# EAGLE schematic PnP-Expansion-V1 (EAGLE 9.3.0)

## Sheet 1 of 4
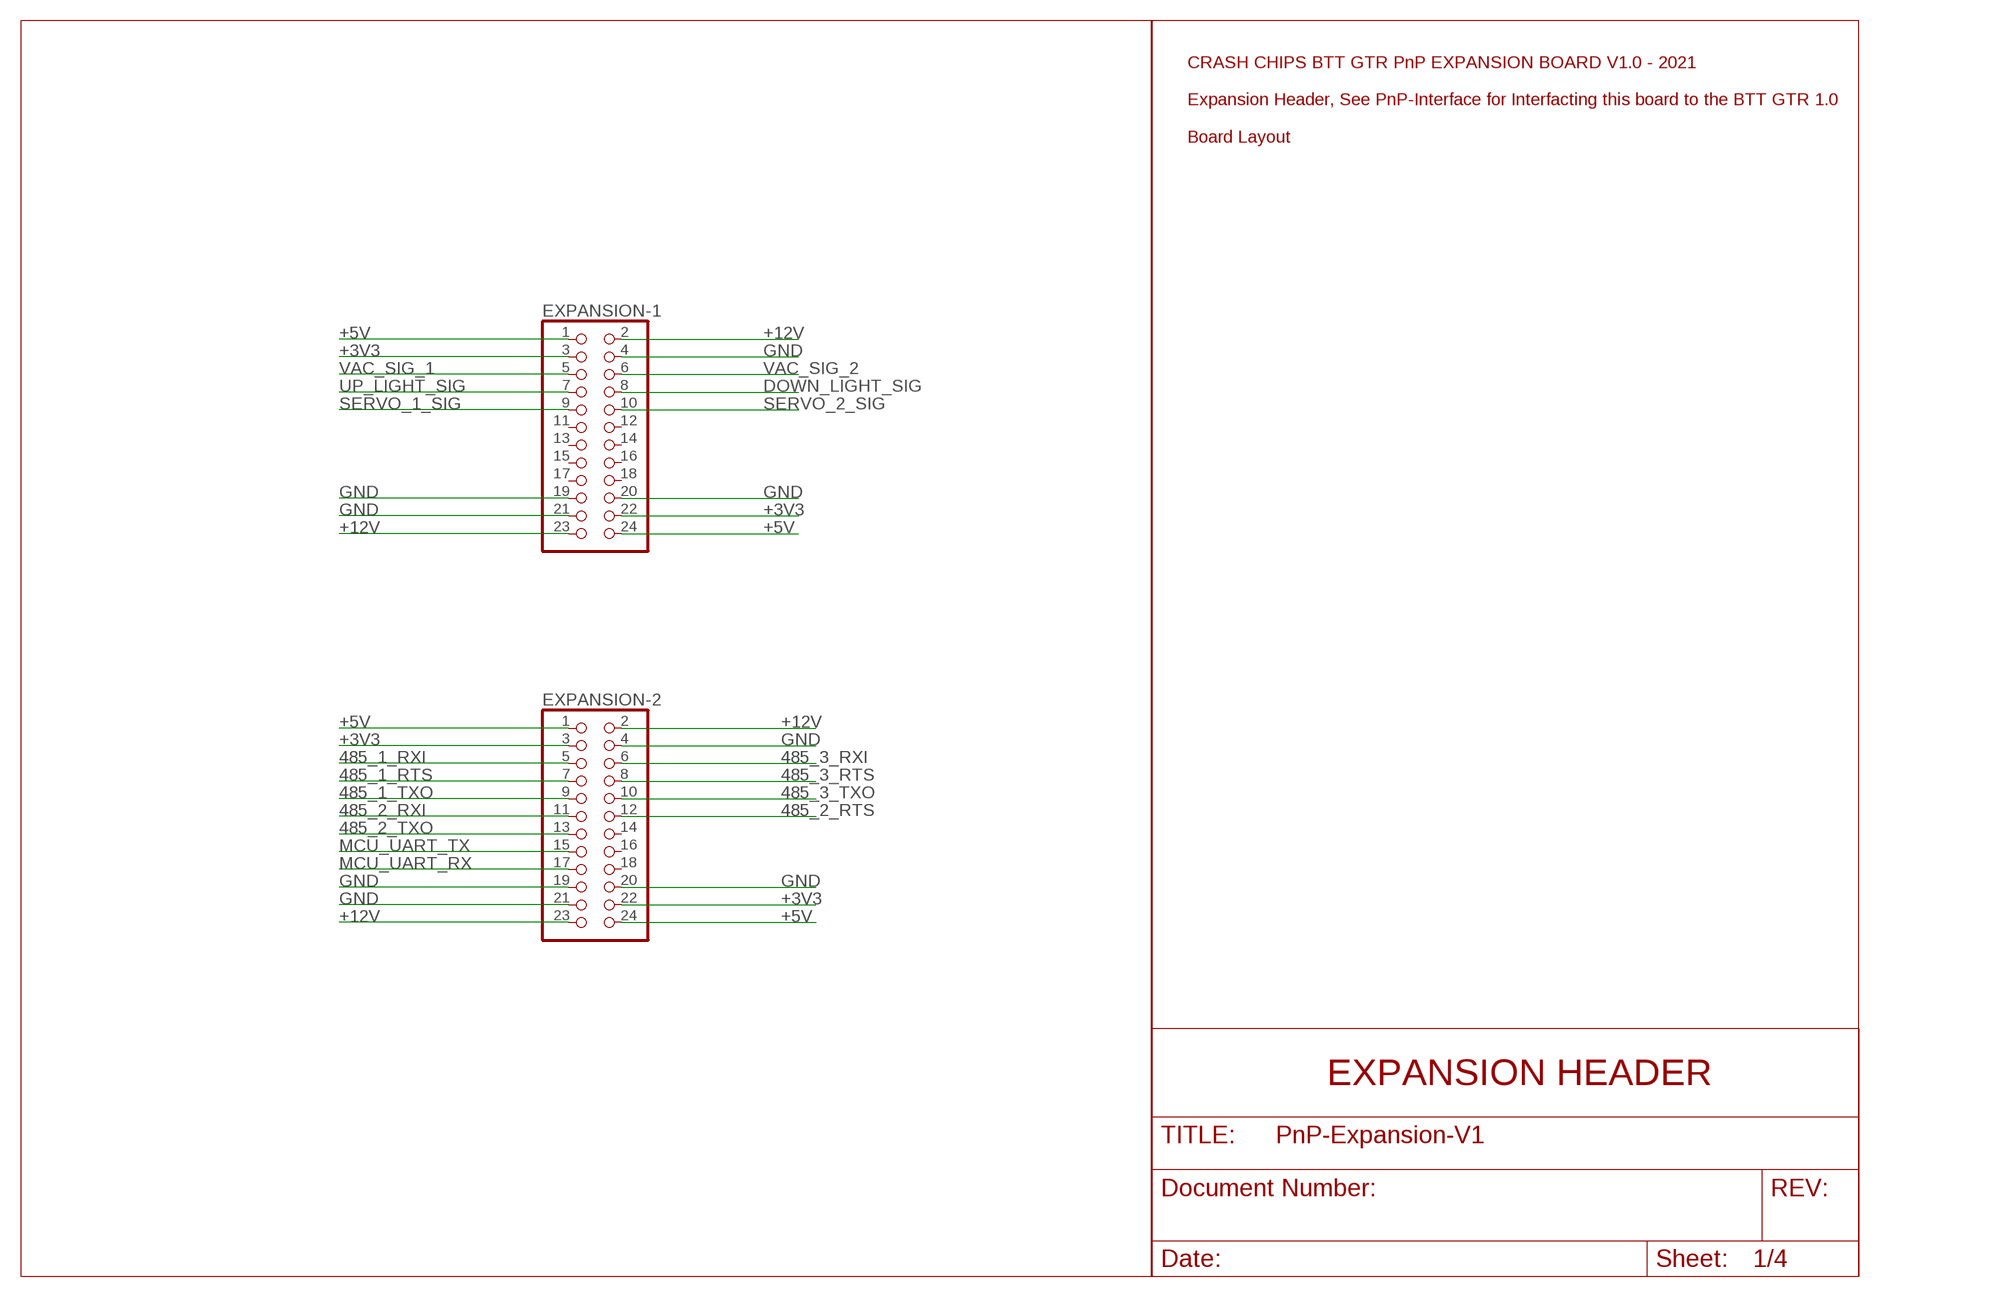
[diagram p0: schematic, sheet 1]

### Parts
EXPANSION-1  PINHD-2X12  [2X12]
EXPANSION-2  PINHD-2X12  [2X12]

### Nets
485_1_RTS: EXPANSION-2.7 ; also sheet 2
485_1_RXI: EXPANSION-2.5 ; also sheet 2
485_1_TXO: EXPANSION-2.9 ; also sheet 2
485_2_RTS: EXPANSION-2.12 ; also sheet 2
485_2_RXI: EXPANSION-2.11 ; also sheet 2
485_2_TXO: EXPANSION-2.13 ; also sheet 2
485_3_RTS: EXPANSION-2.8 ; also sheet 2
485_3_RXI: EXPANSION-2.6 ; also sheet 2
485_3_TXO: EXPANSION-2.10 ; also sheet 2
+3V3: EXPANSION-1.3 EXPANSION-1.22 EXPANSION-2.3 EXPANSION-2.22 ; also sheet 2,3
+5V: EXPANSION-1.1 EXPANSION-1.24 EXPANSION-2.1 EXPANSION-2.24 ; also sheet 2,3,4
+12V: EXPANSION-1.2 EXPANSION-1.23 EXPANSION-2.2 EXPANSION-2.23 ; also sheet 4
DOWN_LIGHT_SIG: EXPANSION-1.8 ; also sheet 3
GND: EXPANSION-1.4 EXPANSION-1.19 EXPANSION-1.20 EXPANSION-1.21 EXPANSION-2.4 EXPANSION-2.19 EXPANSION-2.20 EXPANSION-2.21 ; also sheet 2,3,4
MCU_UART_RX: EXPANSION-2.17 ; also sheet 3
MCU_UART_TX: EXPANSION-2.15 ; also sheet 3
SERVO_1_SIG: EXPANSION-1.9 ; also sheet 3
SERVO_2_SIG: EXPANSION-1.10 ; also sheet 3
UP_LIGHT_SIG: EXPANSION-1.7 ; also sheet 3
VAC_SIG_1: EXPANSION-1.5 ; also sheet 4
VAC_SIG_2: EXPANSION-1.6 ; also sheet 4
Unconnected: EXPANSION-1.11 EXPANSION-1.12 EXPANSION-1.13 EXPANSION-1.14 EXPANSION-1.15 EXPANSION-1.16 EXPANSION-1.17 EXPANSION-1.18 EXPANSION-2.14 EXPANSION-2.16 EXPANSION-2.18

### Notes on the sheet
- CRASH CHIPS BTT GTR PnP EXPANSION BOARD V1.0 - 2021
  
  Expansion Header, See PnP-Interface for Interfacting this board to the BTT GTR 1.0
  
  Board Layout
- EXPANSION HEADER

## Sheet 2 of 4
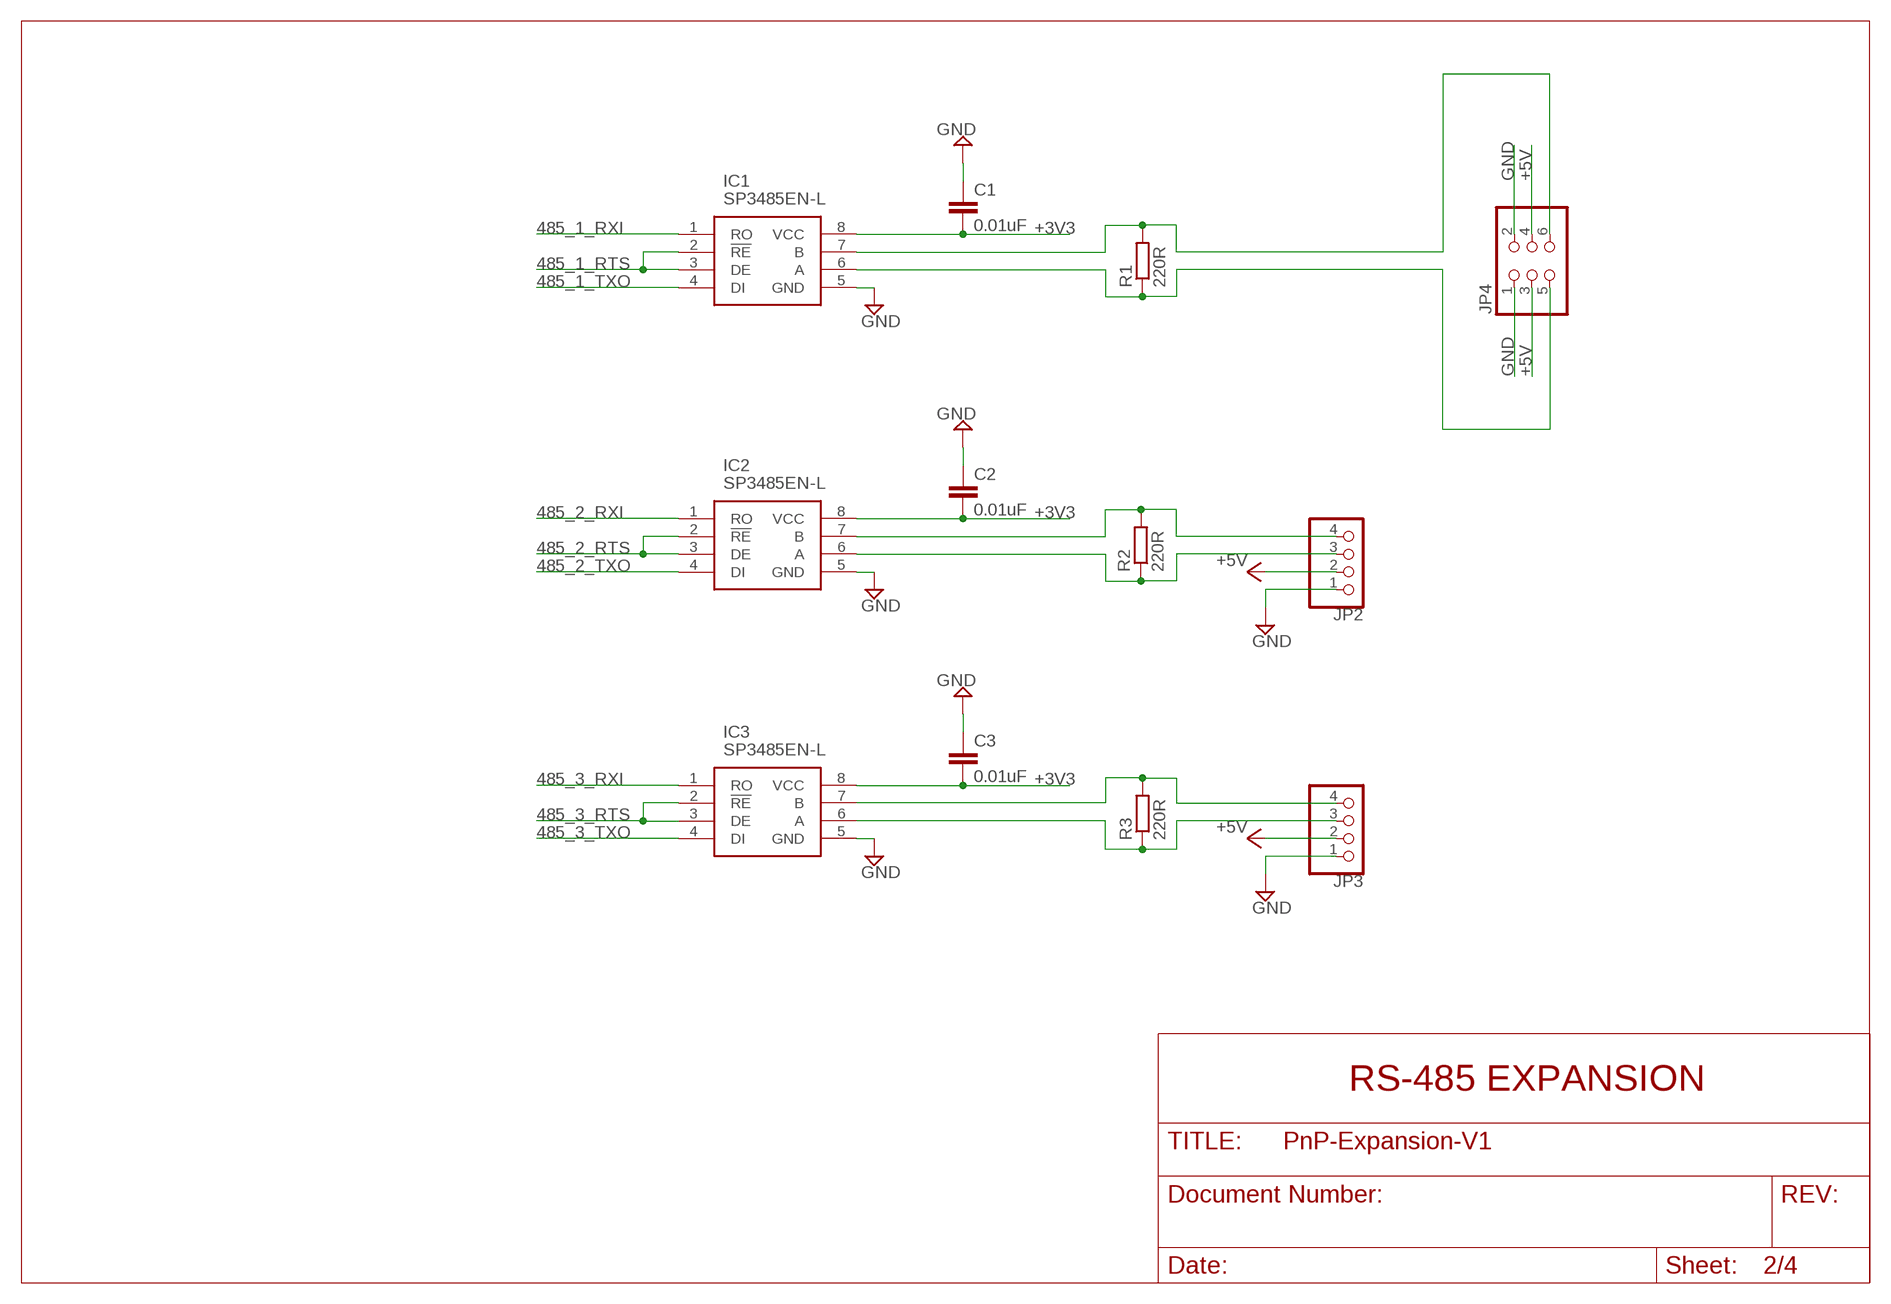
[diagram p1: schematic, sheet 2]

### Parts
C1  0.01uF  C-EUC0805  [C0805]
C2  0.01uF  C-EUC0805  [C0805]
C3  0.01uF  C-EUC0805  [C0805]
IC1  SP3485EN-L  [SOIC127P600X175-8N]
IC2  SP3485EN-L  [SOIC127P600X175-8N]
IC3  SP3485EN-L  [SOIC127P600X175-8N]
JP2  PINHD-1X4  [1X04]
JP3  PINHD-1X4  [1X04]
JP4  PINHD-2X3  [2X03]
R1  220R  R-EU_M0805  [M0805]
R2  220R  R-EU_M0805  [M0805]
R3  220R  R-EU_M0805  [M0805]

### Nets
485_1_RTS: IC1.2(!RE) IC1.3(DE) ; also sheet 1
485_1_RXI: IC1.1(RO) ; also sheet 1
485_1_TXO: IC1.4(DI) ; also sheet 1
485_2_RTS: IC2.2(!RE) IC2.3(DE) ; also sheet 1
485_2_RXI: IC2.1(RO) ; also sheet 1
485_2_TXO: IC2.4(DI) ; also sheet 1
485_3_RTS: IC3.2(!RE) IC3.3(DE) ; also sheet 1
485_3_RXI: IC3.1(RO) ; also sheet 1
485_3_TXO: IC3.4(DI) ; also sheet 1
+3V3: C1.2 C2.2 C3.2 IC1.8(VCC) IC2.8(VCC) IC3.8(VCC) ; also sheet 1,3
+5V: JP2.2 JP3.2 JP4.3 JP4.4 ; also sheet 1,3,4
GND: C1.1 C2.1 C3.1 IC1.5(GND) IC2.5(GND) IC3.5(GND) JP2.1 JP3.1 JP4.1 JP4.2 ; also sheet 1,3,4
N$1: IC3.7(B) JP3.4 R3.2
N$2: IC3.6(A) JP3.3 R3.1
N$3: IC2.6(A) JP2.3 R2.1
N$4: IC2.7(B) JP2.4 R2.2
N$6: IC1.6(A) JP4.5 R1.1
N$30: IC1.7(B) JP4.6 R1.2

### Notes on the sheet
- RS-485 EXPANSION

## Sheet 3 of 4
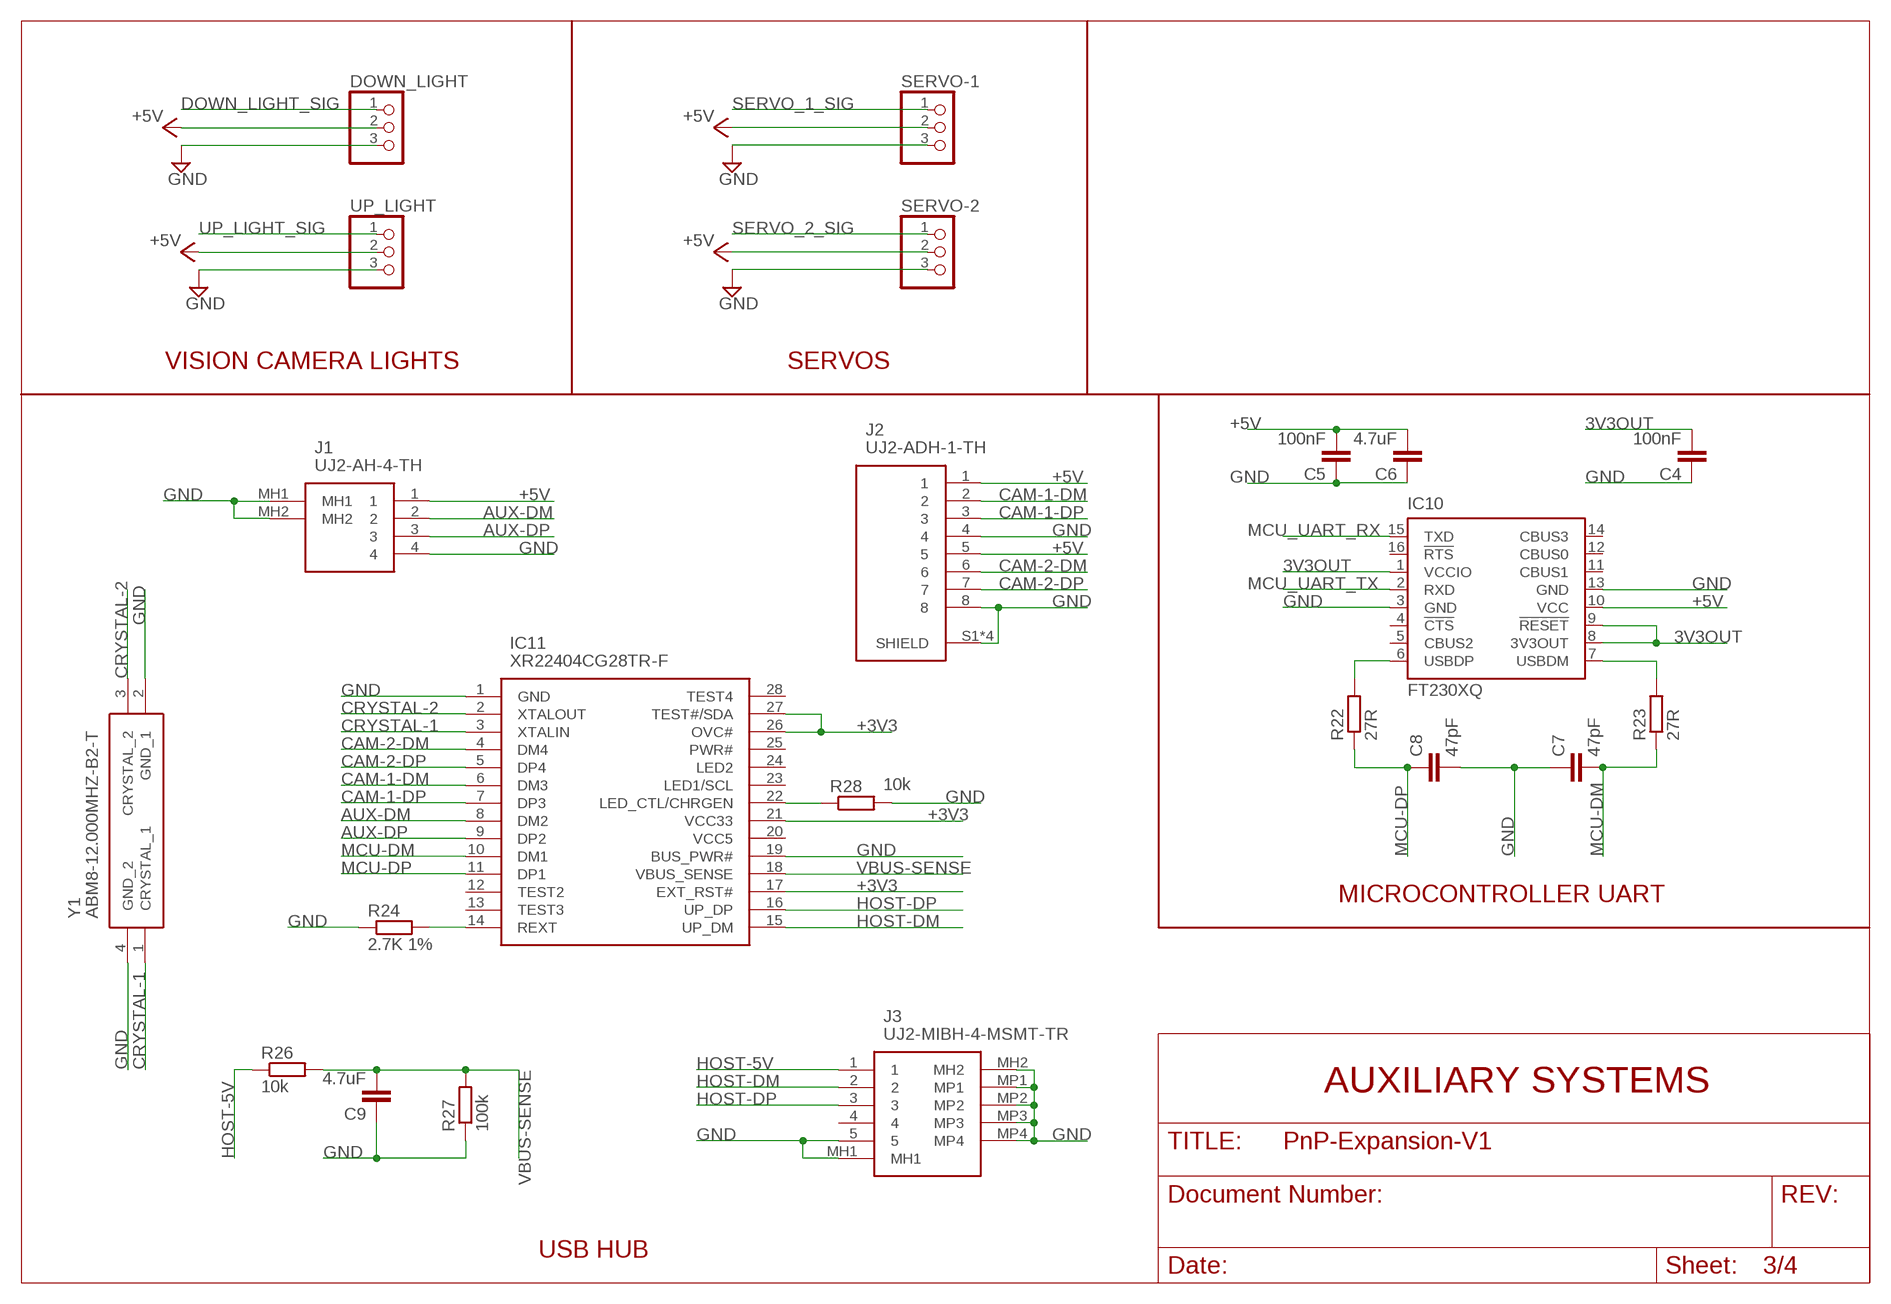
[diagram p2: schematic, sheet 3]

### Parts
C4  100nF  C-EUC0805  [C0805]
C5  100nF  C-EUC0805  [C0805]
C6  4.7uF  C-EUC0805  [C0805]
C7  47pF  C-EUC0805  [C0805]
C8  47pF  C-EUC0805  [C0805]
C9  4.7uF  C-EUC0805  [C0805]
DOWN_LIGHT  PINHD-1X3  [1X03]
IC10  FT230XQ  [QFN16]
IC11  XR22404CG28TR-F  [SOP64P600X173-28N]
J1  UJ2-AH-4-TH  [UJ2AH4TH]
J2  UJ2-ADH-1-TH  [CUI_UJ2-ADH-1-TH]
J3  UJ2-MIBH-4-MSMT-TR  [UJ2MIBH4MSMTTR]
R22  27R  R-EU_M0805  [M0805]
R23  27R  R-EU_M0805  [M0805]
R24  2.7K 1%  R-EU_M0805  [M0805]
R26  10k  R-EU_M0805  [M0805]
R27  100k  R-EU_M0805  [M0805]
R28  10k  R-EU_M0805  [M0805]
SERVO-1  PINHD-1X3  [1X03]
SERVO-2  PINHD-1X3  [1X03]
UP_LIGHT  PINHD-1X3  [1X03]
Y1  ABM8-12.000MHZ-B2-T  [ABM812000MHZB2T]

### Nets
3V3OUT: C4.1 IC10.1(VCCIO) IC10.8(3V3OUT) IC10.9(!RESET)
+3V3: IC11.17(EXT_RST#) IC11.21(VCC33) IC11.26(OVC#) IC11.27(TEST#/SDA) ; also sheet 1,2
+5V: C5.2 C6.2 DOWN_LIGHT.2 IC10.10(VCC) J1.1 J2.1 J2.5 SERVO-1.2 SERVO-2.2 UP_LIGHT.2 ; also sheet 1,2,4
AUX-DM: IC11.8(DM2) J1.2
AUX-DP: IC11.9(DP2) J1.3
CAM-1-DM: IC11.6(DM3) J2.2
CAM-1-DP: IC11.7(DP3) J2.3
CAM-2-DM: IC11.4(DM4) J2.6
CAM-2-DP: IC11.5(DP4) J2.7
CRYSTAL-1: IC11.3(XTALIN) Y1.1(CRYSTAL_1)
CRYSTAL-2: IC11.2(XTALOUT) Y1.3(CRYSTAL_2)
DOWN_LIGHT_SIG: DOWN_LIGHT.1 ; also sheet 1
GND: C4.2 C5.1 C6.1 C7.1 C8.2 C9.1 DOWN_LIGHT.3 IC10.3(GND) IC10.13(GND) IC11.1(GND) IC11.19(BUS_PWR#) J1.4 J1.MH1 J1.MH2 J2.4 J2.8 J2.S1(SHIELD) J2.S2(SHIELD) J2.S3(SHIELD) J2.S4(SHIELD) J3.5 J3.MH1 J3.MH2 J3.MP1 J3.MP2 J3.MP3 J3.MP4 R24.1 R27.1 R28.2 SERVO-1.3 SERVO-2.3 UP_LIGHT.3 Y1.2(GND_1) Y1.4(GND_2) ; also sheet 1,2,4
HOST-5V: J3.1 R26.1
HOST-DM: IC11.15(UP_DM) J3.2
HOST-DP: IC11.16(UP_DP) J3.3
MCU-DM: C7.2 IC11.10(DM1) R23.1
MCU-DP: C8.1 IC11.11(DP1) R22.1
MCU_UART_RX: IC10.15(TXD) ; also sheet 1
MCU_UART_TX: IC10.2(RXD) ; also sheet 1
N$5: IC11.22(LED_CTL/CHRGEN) R28.1
N$27: IC10.6(USBDP) R22.2
N$28: IC10.7(USBDM) R23.2
N$29: IC11.14(REXT) R24.2
SERVO_1_SIG: SERVO-1.1 ; also sheet 1
SERVO_2_SIG: SERVO-2.1 ; also sheet 1
UP_LIGHT_SIG: UP_LIGHT.1 ; also sheet 1
VBUS-SENSE: C9.2 IC11.18(VBUS_SENSE) R26.2 R27.2
Unconnected: IC10.4(!CTS) IC10.5(CBUS2) IC10.11(CBUS1) IC10.12(CBUS0) IC10.14(CBUS3) IC10.16(!RTS) IC11.12(TEST2) IC11.13(TEST3) IC11.20(VCC5) IC11.23(LED1/SCL) IC11.24(LED2) IC11.25(PWR#) IC11.28(TEST4) J3.4

### Notes on the sheet
- VISION CAMERA LIGHTS | SERVOS
- MICROCONTROLLER UART
- AUXILIARY SYSTEMS
- USB HUB

## Sheet 4 of 4
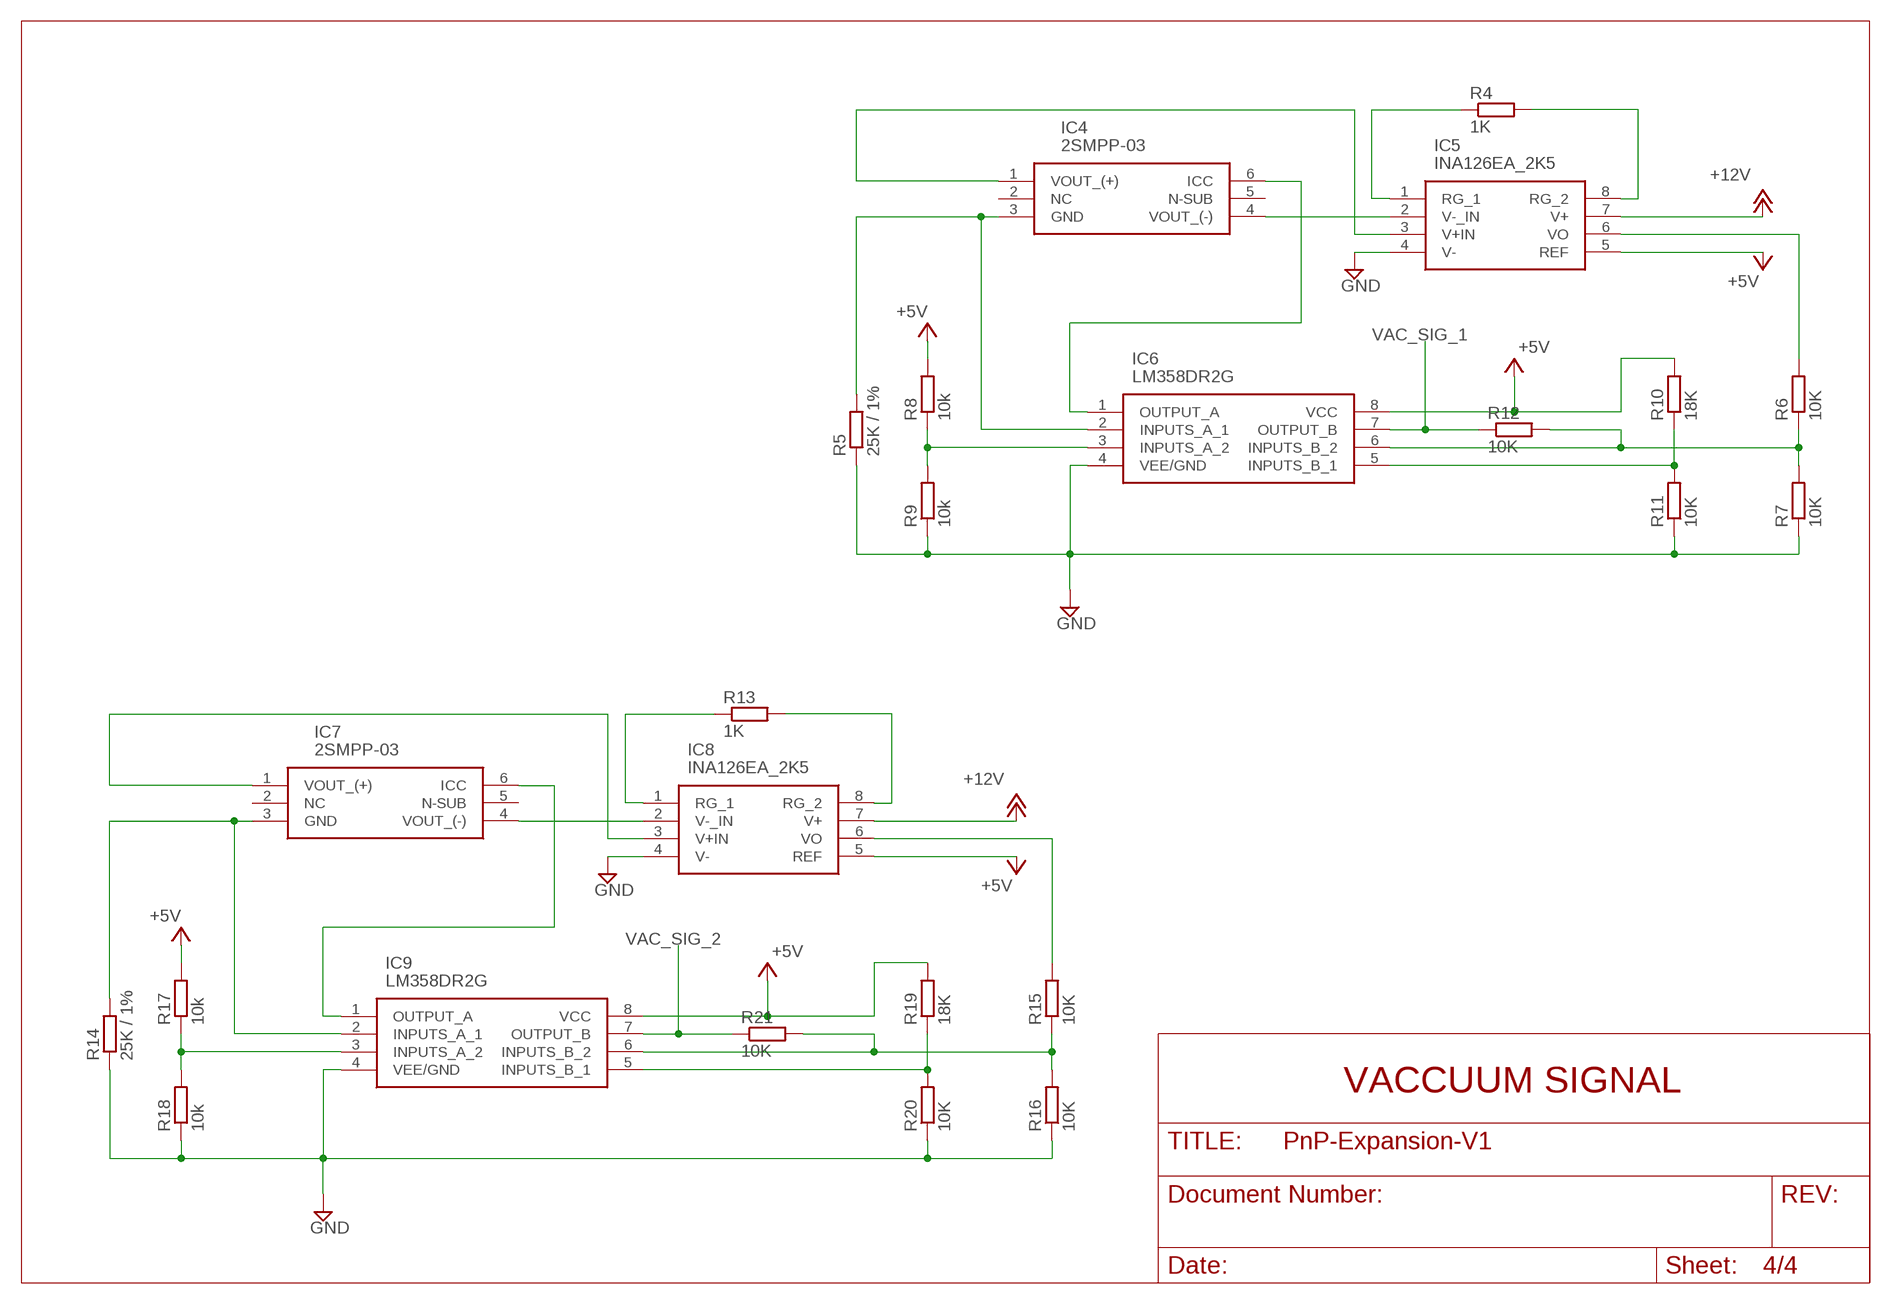
[diagram p3: schematic, sheet 4]

### Parts
IC4  2SMPP-03  [2SMPP03]
IC5  INA126EA_2K5  [SOP65P490X110-8N]
IC6  LM358DR2G  [SOIC127P600X175-8N]
IC7  2SMPP-03  [2SMPP03]
IC8  INA126EA_2K5  [SOP65P490X110-8N]
IC9  LM358DR2G  [SOIC127P600X175-8N]
R4  1K  R-EU_M0805  [M0805]
R5  25K / 1%  R-EU_M0805  [M0805]
R6  10K  R-EU_M0805  [M0805]
R7  10K  R-EU_M0805  [M0805]
R8  10k  R-EU_M0805  [M0805]
R9  10k  R-EU_M0805  [M0805]
R10  18K  R-EU_M0805  [M0805]
R11  10K  R-EU_M0805  [M0805]
R12  10K  R-EU_M0805  [M0805]
R13  1K  R-EU_M0805  [M0805]
R14  25K / 1%  R-EU_M0805  [M0805]
R15  10K  R-EU_M0805  [M0805]
R16  10K  R-EU_M0805  [M0805]
R17  10k  R-EU_M0805  [M0805]
R18  10k  R-EU_M0805  [M0805]
R19  18K  R-EU_M0805  [M0805]
R20  10K  R-EU_M0805  [M0805]
R21  10K  R-EU_M0805  [M0805]

### Nets
+5V: IC5.5(REF) IC6.8(VCC) IC8.5(REF) IC9.8(VCC) R8.2 R10.2 R17.2 R19.2 ; also sheet 1,2,3
+12V: IC5.7(V+) IC8.7(V+) ; also sheet 1
GND: IC5.4(V-) IC6.4(VEE/GND) IC8.4(V-) IC9.4(VEE/GND) R5.1 R7.1 R9.1 R11.1 R14.1 R16.1 R18.1 R20.1 ; also sheet 1,2,3
N$7: IC4.1(VOUT_(+)) IC5.3(V+IN)
N$8: IC5.1(RG_1) R4.1
N$9: IC5.8(RG_2) R4.2
N$10: IC4.4(VOUT_(-)) IC5.2(V-_IN)
N$11: IC4.6(ICC) IC6.1(OUTPUT_A)
N$12: IC4.3(GND) IC6.2(INPUTS_A_1) R5.2
N$13: IC6.3(INPUTS_A_2) R8.1 R9.2
N$14: IC5.6(VO) R6.2
N$15: IC6.6(INPUTS_B_2) R6.1 R7.2 R12.2
N$16: IC6.5(INPUTS_B_1) R10.1 R11.2
N$17: IC7.1(VOUT_(+)) IC8.3(V+IN)
N$18: IC8.1(RG_1) R13.1
N$19: IC8.8(RG_2) R13.2
N$20: IC7.4(VOUT_(-)) IC8.2(V-_IN)
N$21: IC7.6(ICC) IC9.1(OUTPUT_A)
N$22: IC7.3(GND) IC9.2(INPUTS_A_1) R14.2
N$23: IC9.3(INPUTS_A_2) R17.1 R18.2
N$24: IC8.6(VO) R15.2
N$25: IC9.6(INPUTS_B_2) R15.1 R16.2 R21.2
N$26: IC9.5(INPUTS_B_1) R19.1 R20.2
VAC_SIG_1: IC6.7(OUTPUT_B) R12.1 ; also sheet 1
VAC_SIG_2: IC9.7(OUTPUT_B) R21.1 ; also sheet 1
Unconnected: IC4.2(NC) IC4.5(N-SUB) IC7.2(NC) IC7.5(N-SUB)

### Notes on the sheet
- VACCUUM SIGNAL

## Library data of the parts
C1-C9 = rcl:C-EU: CAPACITOR, European symbol; SPICEPREFIX: C
DOWN_LIGHT SERVO-1 SERVO-2 UP_LIGHT = pinhead:PINHD-1X3: PIN HEADER
EXPANSION-1 EXPANSION-2 = pinhead:PINHD-2X12: PIN HEADER
IC1-IC3 = SP3485EN-L:SP3485EN-L: Transceiver RS-485 3.3V 10Mbps SOIC8 SP3485EN-L, Line Transceiver, RS-485, RS-422 10Mbit/s Differential, 3.3 V, 8-Pin SOIC Source: Datasheet <http://www.exar.com/common/content/document.ashx?id=639&type=datasheet&part=sp3485/.pdf>; ARROW_PART_NUMBER: SP3485EN-L; ARROW_PRICE-STOCK: https://www.arrow.com/en/products/sp3485en-l/exar; DESCRIPTION: Transceiver RS-485 3.3V 10Mbps SOIC8 SP3485EN-L, Line Transceiver, RS-485, RS-422 10Mbit/s Differential, 3.3 V, 8-Pin SOIC; HEIGHT: 1.75mm; MANUFACTURER_NAME: EXAR; MANUFACTURER_PART_NUMBER: SP3485EN-L; MOUSER_PART_NUMBER: 701-SP3485EN-L; MOUSER_PRICE-STOCK: https://www.mouser.com/Search/Refine.aspx?Keyword=701-SP3485EN-L
IC4 IC7 = 2SMPP-03:2SMPP-03: OMRON ELECTRONIC COMPONENTS - 2SMPP-03 - SENSOR, PRESSURE, -50 TO 50KPA, 1, 2.6MM Source: Datasheet <http://omronfs.omron.com/en_US/ecb/products/pdf/en-2smpp-03.pdf>; ARROW_PART_NUMBER: 2SMPP-03; ARROW_PRICE-STOCK: https://www.arrow.com/en/products/2smpp-03/omron; DESCRIPTION: OMRON ELECTRONIC COMPONENTS - 2SMPP-03 - SENSOR, PRESSURE, -50 TO 50KPA, 1, 2.6MM; HEIGHT: 3mm; MANUFACTURER_NAME: Omron Electronics; MANUFACTURER_PART_NUMBER: 2SMPP-03; MOUSER_PART_NUMBER: 653-2SMPP-03; MOUSER_PRICE-STOCK: https://www.mouser.co.uk/ProductDetail/Omron-Electronics/2SMPP-03?qs=4pif%2FGVLGwewIGFtpGK49A%3D%3D
IC5 IC8 = INA126EA_2K5:INA126EA_2K5: Micropower Instrumentation Amplifier Single and Dual Versions Source: Datasheet <http://www.ti.com/lit/gpn/INA126>; ARROW_PART_NUMBER: INA126EA/2K5; ARROW_PRICE-STOCK: https://www.arrow.com/en/products/ina126ea2k5/texas-instruments; DESCRIPTION: Micropower Instrumentation Amplifier Single and Dual Versions; HEIGHT: 1.1mm; MANUFACTURER_NAME: Texas Instruments; MANUFACTURER_PART_NUMBER: INA126EA/2K5; MOUSER_PART_NUMBER: 595-INA126EA/2K5; MOUSER_PRICE-STOCK: https://www.mouser.co.uk/ProductDetail/Texas-Instruments/INA126EA-2K5/?qs=VBduBm9rCJSYx1fsyzaOGQ%3D%3D
IC6 IC9 = LM358DR2G:LM358DR2G: LM358DR2G, Dual Operational Amplifier 5 to 28V, 8-Pin SOIC Source: Datasheet <http://www.onsemi.com/pub/Collateral/LM358-D.PDF>; ARROW_PART_NUMBER: LM358DR2G; ARROW_PRICE-STOCK: https://www.arrow.com/en/products/lm358dr2g/on-semiconductor; DESCRIPTION: LM358DR2G, Dual Operational Amplifier 5 to 28V, 8-Pin SOIC; HEIGHT: 1.75mm; MANUFACTURER_NAME: ON Semiconductor; MANUFACTURER_PART_NUMBER: LM358DR2G; MOUSER_PART_NUMBER: 863-LM358DR2G; MOUSER_PRICE-STOCK: https://www.mouser.co.uk/ProductDetail/ON-Semiconductor/LM358DR2G/?qs=2OtswVQKCOFTvDtJvQ3XHw%3D%3D
IC10 = ftdichip:FT230X: USB to BASIC UART IC Auto generated by make-symbol-device-package-bsdl.ulp Rev. 43 Source: Data sheet <http://www.ftdichip.com/Support/Documents/DataSheets/ICs/DS_FT230X.pdf>
IC11 = XR22404CG28TR-F:XR22404CG28TR-F: IC USB 2.0 4-PORT HUB 28SSOP Source: Datasheet <https://www.maxlinear.com/document?id=22105>; DESCRIPTION: IC USB 2.0 4-PORT HUB 28SSOP; HEIGHT: 1.73mm; MANUFACTURER_NAME: MaxLinear, Inc.; MANUFACTURER_PART_NUMBER: XR22404CG28TR-F; MOUSER_PART_NUMBER: 701-XR22404CG28TR-F; MOUSER_PRICE-STOCK: https://www.mouser.co.uk/ProductDetail/MaxLinear/XR22404CG28TR-F?qs=pMEWzlIAYnay3yoEWcwQ0g%3D%3D
J1 = UJ2-AH-4-TH:UJ2-AH-4-TH: USB Connectors USB 2.0 type A jack 4 pin Horizontal TH Source: Datasheet <https://www.cui.com/product/resource/uj2-ah-4-th.pdf>; ARROW_PART_NUMBER: UJ2-AH-4-TH; ARROW_PRICE-STOCK: https://www.arrow.com/en/products/uj2-ah-4-th/cui-devices; DESCRIPTION: USB Connectors USB 2.0 type A jack 4 pin Horizontal TH; HEIGHT: 6.94mm; MANUFACTURER_NAME: CUI Inc.; MANUFACTURER_PART_NUMBER: UJ2-AH-4-TH; MOUSER_PART_NUMBER: 490-UJ2-AH-4-TH; MOUSER_PRICE-STOCK: https://www.mouser.co.uk/ProductDetail/CUI-Devices/UJ2-AH-4-TH/?qs=5mqXD9RfOg1V4xKoNh4Gxg%3D%3D
J2 = UJ2-ADH-1-TH:UJ2-ADH-1-TH: Standard A Type 8 Pin Horizontal 3 µin Plating Through Hole USB Jack 2.0 Check prices <https://pricing.snapeda.com/parts/UJ2-ADH-1-TH/CUI%20Devices/view-part?ref=eda>; MANUFACTURER: CUI Devices; STANDARD: Manufacturer Recommendations
J3 = UJ2-MIBH-4-MSMT-TR:UJ2-MIBH-4-MSMT-TR: USB Connectors USB 2.0 micro B jack 5 pin HZ mid-mnt SMT Source: Datasheet <https://componentsearchengine.com/Datasheets/1/UJ2-MIBH-4-MSMT-TR.pdf>; ARROW_PART_NUMBER: UJ2-MIBH-4-MSMT-TR; ARROW_PRICE-STOCK: https://www.arrow.com/en/products/uj2-mibh-4-msmt-tr/cui-devices; DESCRIPTION: USB Connectors USB 2.0 micro B jack 5 pin HZ mid-mnt SMT; HEIGHT: 2.45mm; MANUFACTURER_NAME: CUI Inc.; MANUFACTURER_PART_NUMBER: UJ2-MIBH-4-MSMT-TR; MOUSER_PART_NUMBER: 490-UJ2-MIBH-4-MSMT; MOUSER_PRICE-STOCK: https://www.mouser.co.uk/ProductDetail/CUI-Devices/UJ2-MIBH-4-MSMT-TR?qs=5mqXD9RfOg32NvuLASc7Xg%3D%3D
JP2 JP3 = pinhead:PINHD-1X4: PIN HEADER
JP4 = pinhead:PINHD-2X3: PIN HEADER
R1-R24 R26-R28 = rcl:R-EU_: RESISTOR, European symbol; SPICEPREFIX: R
Y1 = ABM8-12.000MHz-B2-T:ABM8-12.000MHZ-B2-T: ABRACON - ABM8-12.000MHZ-B2-T - Crystal, 12 MHz, SMD, 3.2mm x 2.5mm, 50 ppm, 18 pF, 20 ppm, ABM8 Series Source: Datasheet <https://datasheet.datasheetarchive.com/originals/dk/DKDS41/DSANUWW0031052.pdf>; ARROW_PART_NUMBER: ABM8-12.000MHZ-B2-T; ARROW_PRICE-STOCK: https://www.arrow.com/en/products/abm8-12.000mhz-b2-t/abracon; DESCRIPTION: ABRACON - ABM8-12.000MHZ-B2-T - Crystal, 12 MHz, SMD, 3.2mm x 2.5mm, 50 ppm, 18 pF, 20 ppm, ABM8 Series; HEIGHT: 0.8mm; MANUFACTURER_NAME: ABRACON; MANUFACTURER_PART_NUMBER: ABM8-12.000MHz-B2-T; MOUSER_PART_NUMBER: 815-ABM8-12-B2-T; MOUSER_PRICE-STOCK: https://www.mouser.co.uk/ProductDetail/ABRACON/ABM8-12000MHZ-B2-T?qs=hjiqo2PPvpiyy6%252BNWm3IZg%3D%3D